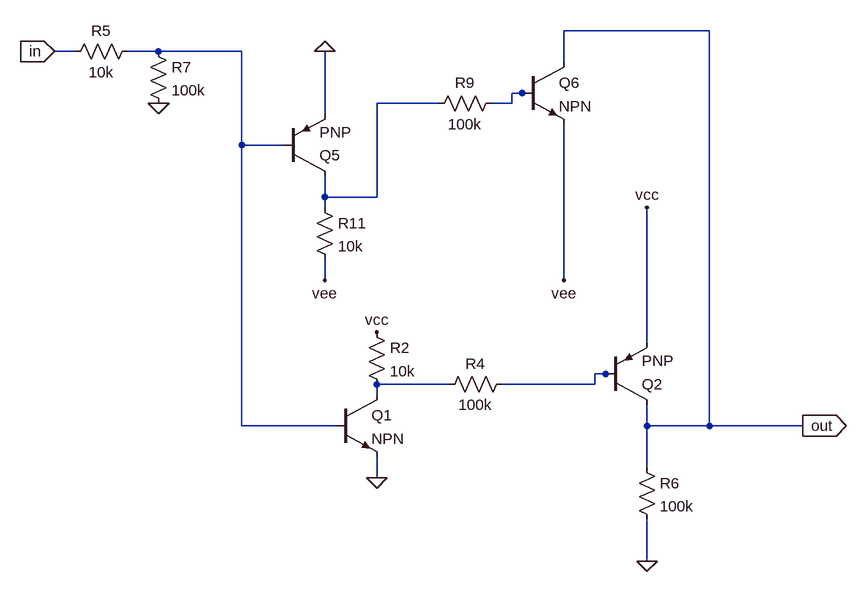
[diagram p0: schematic TBUFF.asc]
TBUFF.asc, the LTspice schematic file:
Version 4
SHEET 1 1456 780
WIRE 112 -848 -112 -848
WIRE -864 -816 -896 -816
WIRE -736 -816 -784 -816
WIRE -608 -816 -736 -816
WIRE -112 -800 -112 -848
WIRE -176 -752 -192 -752
WIRE -160 -752 -176 -752
WIRE -304 -736 -400 -736
WIRE -192 -736 -192 -752
WIRE -192 -736 -224 -736
WIRE -480 -720 -480 -816
WIRE -608 -672 -608 -816
WIRE -544 -672 -608 -672
WIRE -480 -592 -480 -624
WIRE -400 -592 -400 -736
WIRE -400 -592 -480 -592
WIRE -480 -576 -480 -592
WIRE -480 -464 -480 -496
WIRE -112 -464 -112 -704
WIRE 16 -368 16 -576
WIRE -48 -320 -64 -320
WIRE -32 -320 -48 -320
WIRE -288 -304 -400 -304
WIRE -64 -304 -64 -320
WIRE -64 -304 -208 -304
WIRE -400 -288 -400 -304
WIRE -608 -240 -608 -672
WIRE -464 -240 -608 -240
WIRE 16 -240 16 -272
WIRE 112 -240 112 -848
WIRE 112 -240 16 -240
WIRE 256 -240 112 -240
WIRE 16 -176 16 -240
WIRE -400 -160 -400 -192
WIRE 16 -32 16 -96
FLAG 256 -240 out
IOPIN 256 -240 Out
FLAG -400 -160 0
FLAG -400 -384 vcc
FLAG 16 -32 0
FLAG 16 -576 vcc
FLAG -896 -816 in
IOPIN -896 -816 In
FLAG -736 -736 0
FLAG -480 -464 vee
FLAG -112 -464 vee
FLAG -480 -816 0
SYMBOL Res -416 -400 R0
SYMATTR InstName R2
SYMATTR Value 10k
SYMBOL npn -464 -288 R0
SYMATTR InstName Q1
SYMBOL Res -192 -320 R90
WINDOW 0 0 56 VBottom 2
WINDOW 3 32 56 VTop 2
SYMATTR InstName R4
SYMATTR Value 100k
SYMBOL Res 0 -192 R0
SYMATTR InstName R6
SYMATTR Value 100k
SYMBOL pnp -48 -272 M180
SYMATTR InstName Q2
SYMBOL Res -768 -832 R90
WINDOW 0 0 56 VBottom 2
WINDOW 3 32 56 VTop 2
SYMATTR InstName R5
SYMATTR Value 10k
SYMBOL Res -752 -832 R0
SYMATTR InstName R7
SYMATTR Value 100k
SYMBOL Res -208 -752 R90
WINDOW 0 0 56 VBottom 2
WINDOW 3 32 56 VTop 2
SYMATTR InstName R9
SYMATTR Value 100k
SYMBOL Res -496 -592 R0
SYMATTR InstName R11
SYMATTR Value 10k
SYMBOL pnp -544 -624 M180
SYMATTR InstName Q5
SYMBOL npn -176 -800 R0
SYMATTR InstName Q6

The netlist it stands for:
* TBUFF.asc
R2 vcc N005 10k
Q1 N005 N001 0 0 NPN
R4 N004 N005 100k
R6 out 0 100k
Q2 out N004 vcc 0 PNP
R5 N001 in 10k
R7 N001 0 100k
R9 N002 N003 100k
R11 N003 vee 10k
Q5 N003 N001 0 0 PNP
Q6 out N002 vee 0 NPN
.model NPN NPN
.model PNP PNP
.lib standard.bjt
.backanno
.end